# Altium schematic sheet NFC_NXP.SchDoc
size 209 x 148 mm; DocumentNumber: 1; SheetNumber: 1; SheetTotal: 1
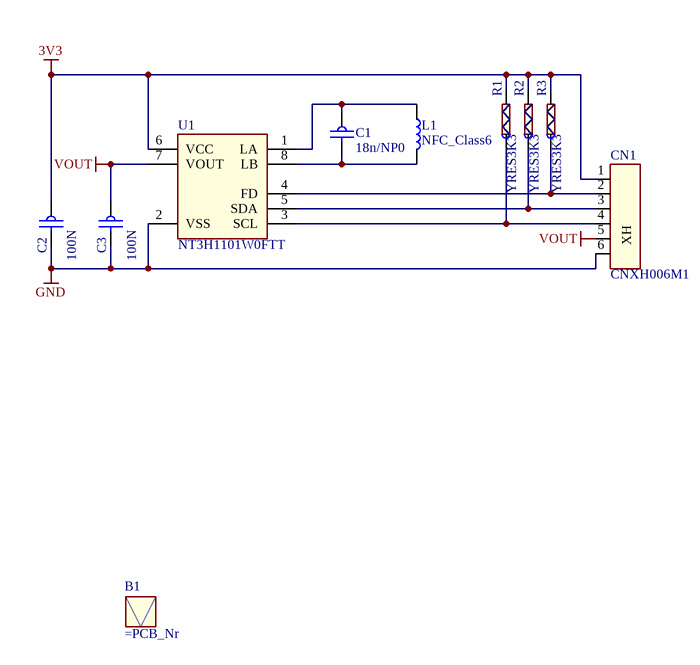
[diagram p0: NFC_NXP.SchDoc]

## Parts
B1  (no value)  [MC_BoardNr]
C1  18n/NP0  [CA_STD1206_H16]
C2  100N  [CA_STD1206_H16]
C3  100N  [CA_STD1206_H16]
CN1  CNXH006M1  [CN_JST-B6B-XH]
L1  NFC_Class6  [CL_NFC_Class6]  (net tie, no BOM)
R1  YRES3K3  [RE_STD1206_H6]
R2  YRES3K3  [RE_STD1206_H6]
R3  YRES3K3  [RE_STD1206_H6]
U1  NT3H1101W0FTT  [SC_TSSOP8_N]

## Nets
3V3: C2.1 CN1.1 R1.2 R2.2 R3.2 U1.6(VCC)
GND: C2.2 C3.2 CN1.6 U1.2(VSS)
VOUT: C3.1 CN1.5 U1.7(VOUT)
NetC1_1: C1.1 L1.1 U1.1(LA)
NetC1_2: C1.2 L1.2 U1.8(LB)
NetCN1_2: CN1.2 R3.1 U1.4(FD)
NetCN1_3: CN1.3 R2.1 U1.5(SDA)
NetCN1_4: CN1.4 R1.1 U1.3(SCL)

## Notes on the sheet
- Title:
- Doc. Name:
- Variant:
- PCB Nr.:
- Rev.:
- Date:
- Drawn by:
- Sheet:
- of
- (in symbol CNXH006M1) XH

## Library data of the parts
B1 = pcb_nr: Bare PCB; Article: pcb_nr; Status: A; Order Code: =PCB_Nr
C1 = 18n/NP0: 18N; Sub Category: Ceramic; Order Code: Farnell 2426902; Article: 18n/NP0; Category: Capacitor; Status: A
C2 C3 = YCAM100N: Chip 100N/50V-X7R; Sub Category: Ceramic; Order Code: FN 1759361; Property 1: 50V; Property 2: X7R; 3D_model: step; Category: Capacitor; Status: N; Catalogus_Nr: YCAM100N; ComponentLink1URL: https://datasheets.zone2.flir.net:8443/#/article/YCAM100N; ComponentLink1Description: Datasheets; Value: 100N
CN1 = CNXH006M1: HEADER, VERT, 1x6WAY; Sub Category: JST; Order Code: Farnell 1516282; Article: CNXH006M1; Category: Connector; Status: A
L1 = NFC_Class6_coil: Article: NFC_Class6_coil; Category: Inductor; Status: A
R1-R3 = YRES3K3: 3K3; Sub Category: Generic; Order Code: Farnell 2073919 / 2079004; Article: YRES3K3; Category: Resistor; Status: A
U1 = NT3H1101W0FTT: Order Code: samples NXP; Article: NT3H1101W0FTT; Category: IC; Status: A